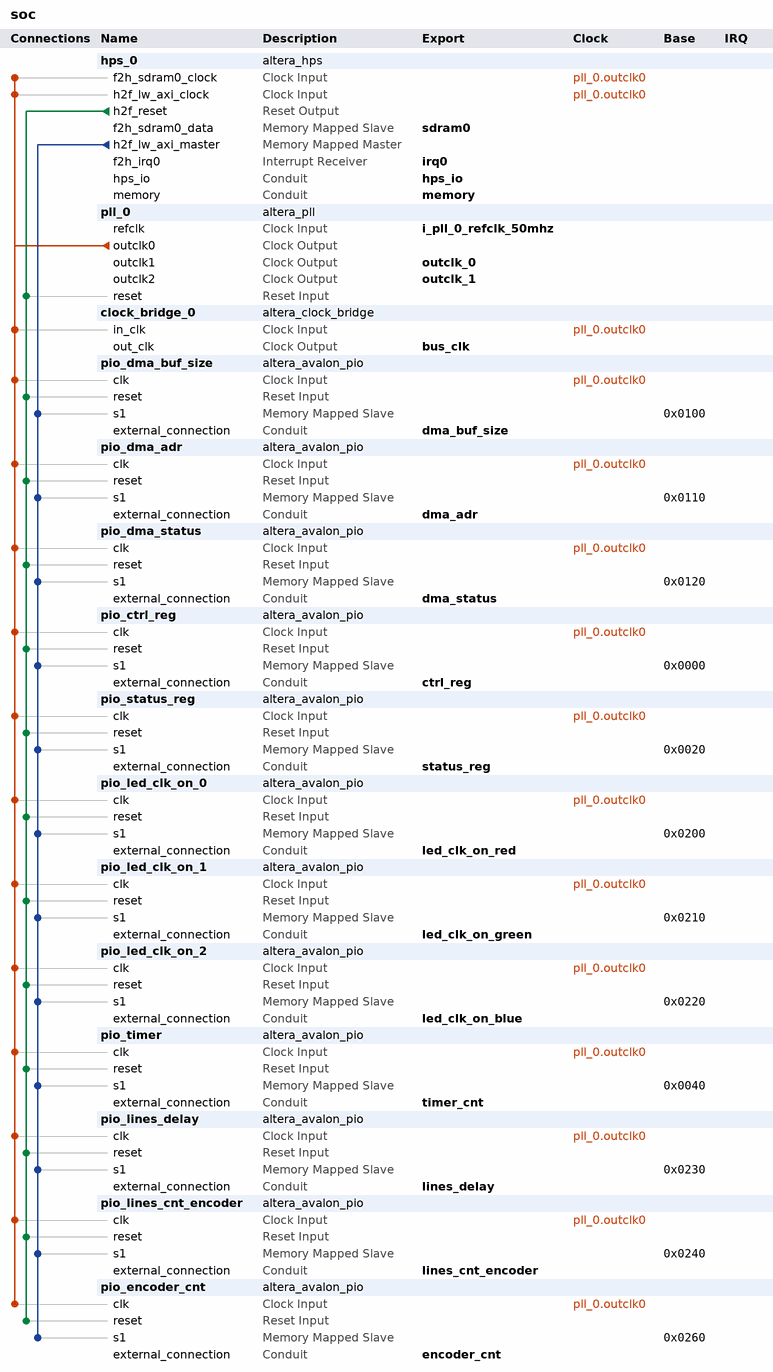
[diagram p0: system contents]
# Platform Designer (Qsys) system soc, Cyclone V 5CSEMA4U23C6
# Parameters at their usual value, and those the tool derives, are not listed.
package require -exact qsys 18.1
create_system soc
set_project_property DEVICE_FAMILY {Cyclone V}
set_project_property DEVICE 5CSEMA4U23C6

add_instance hps_0 altera_hps 18.1
set_instance_parameter_value hps_0 EMAC1_Mode RGMII
set_instance_parameter_value hps_0 EMAC1_PinMuxing {HPS I/O Set 0}
set_instance_parameter_value hps_0 F2SCLK_COLDRST_Enable false
set_instance_parameter_value hps_0 F2SCLK_DBGRST_Enable false
set_instance_parameter_value hps_0 F2SCLK_WARMRST_Enable false
set_instance_parameter_value hps_0 F2SDRAM_Type {Avalon-MM Bidirectional}
set_instance_parameter_value hps_0 F2SDRAM_Width 128
set_instance_parameter_value hps_0 F2SINTERRUPT_Enable true
set_instance_parameter_value hps_0 F2S_Width 0
set_instance_parameter_value hps_0 FPGA_PERIPHERAL_OUTPUT_CLOCK_FREQ_EMAC0_GTX_CLK 125
set_instance_parameter_value hps_0 FPGA_PERIPHERAL_OUTPUT_CLOCK_FREQ_EMAC0_MD_CLK 2.5
set_instance_parameter_value hps_0 FPGA_PERIPHERAL_OUTPUT_CLOCK_FREQ_EMAC1_GTX_CLK 125
set_instance_parameter_value hps_0 FPGA_PERIPHERAL_OUTPUT_CLOCK_FREQ_EMAC1_MD_CLK 2.5
set_instance_parameter_value hps_0 HPS_PROTOCOL DDR3
set_instance_parameter_value hps_0 I2C0_Mode I2C
set_instance_parameter_value hps_0 I2C0_PinMuxing {HPS I/O Set 0}
set_instance_parameter_value hps_0 I2C1_Mode I2C
set_instance_parameter_value hps_0 I2C1_PinMuxing {HPS I/O Set 0}
set_instance_parameter_value hps_0 LWH2F_Enable true
set_instance_parameter_value hps_0 MEM_BANKADDR_WIDTH 3
set_instance_parameter_value hps_0 MEM_CLK_FREQ 400.0
set_instance_parameter_value hps_0 MEM_COL_ADDR_WIDTH 10
set_instance_parameter_value hps_0 MEM_DQ_WIDTH 32
set_instance_parameter_value hps_0 MEM_DRV_STR RZQ/6
set_instance_parameter_value hps_0 MEM_ROW_ADDR_WIDTH 15
set_instance_parameter_value hps_0 MEM_RTT_NOM RZQ/6
set_instance_parameter_value hps_0 MEM_RTT_WR {Dynamic ODT off}
set_instance_parameter_value hps_0 MEM_TCL 7
set_instance_parameter_value hps_0 MEM_TFAW_NS 37.5
set_instance_parameter_value hps_0 MEM_TRAS_NS 35.0
set_instance_parameter_value hps_0 MEM_TRCD_NS 13.75
set_instance_parameter_value hps_0 MEM_TRFC_NS 300.0
set_instance_parameter_value hps_0 MEM_TRP_NS 13.75
set_instance_parameter_value hps_0 MEM_VENDOR Other
set_instance_parameter_value hps_0 MEM_WTCL 6
set_instance_parameter_value hps_0 QSPI_Mode N/A
set_instance_parameter_value hps_0 QSPI_PinMuxing Unused
set_instance_parameter_value hps_0 REF_CLK_FREQ 25.0
set_instance_parameter_value hps_0 S2FCLK_USER2CLK 5
set_instance_parameter_value hps_0 S2F_Width 0
set_instance_parameter_value hps_0 SDIO_Mode {4-bit Data}
set_instance_parameter_value hps_0 SDIO_PinMuxing {HPS I/O Set 0}
set_instance_parameter_value hps_0 SPIM1_Mode {Single Slave Select}
set_instance_parameter_value hps_0 SPIM1_PinMuxing {HPS I/O Set 0}
set_instance_parameter_value hps_0 STM_Enable false
set_instance_parameter_value hps_0 TIMING_BOARD_AC_SKEW 0.02
set_instance_parameter_value hps_0 TIMING_BOARD_AC_TO_CK_SKEW 0.0
set_instance_parameter_value hps_0 TIMING_BOARD_DQ_TO_DQS_SKEW 0.0
set_instance_parameter_value hps_0 TIMING_BOARD_MAX_CK_DELAY 0.6
set_instance_parameter_value hps_0 TIMING_BOARD_MAX_DQS_DELAY 0.6
set_instance_parameter_value hps_0 TIMING_BOARD_SKEW_BETWEEN_DQS 0.02
set_instance_parameter_value hps_0 TIMING_BOARD_SKEW_CKDQS_DIMM_MAX 0.01
set_instance_parameter_value hps_0 TIMING_BOARD_SKEW_CKDQS_DIMM_MIN -0.01
set_instance_parameter_value hps_0 TIMING_BOARD_SKEW_WITHIN_DQS 0.02
set_instance_parameter_value hps_0 TIMING_TDH 125
set_instance_parameter_value hps_0 TIMING_TDQSCK 400
set_instance_parameter_value hps_0 TIMING_TDQSQ 120
set_instance_parameter_value hps_0 TIMING_TDS 50
set_instance_parameter_value hps_0 TIMING_TIH 250
set_instance_parameter_value hps_0 TIMING_TIS 175
set_instance_parameter_value hps_0 TIMING_TQSH 0.38
set_instance_parameter_value hps_0 UART0_Mode {No Flow Control}
set_instance_parameter_value hps_0 UART0_PinMuxing {HPS I/O Set 0}
set_instance_parameter_value hps_0 USB1_Mode SDR
set_instance_parameter_value hps_0 USB1_PinMuxing {HPS I/O Set 0}
set_instance_parameter_value hps_0 desired_cfg_clk_mhz 100.0
set_instance_parameter_value hps_0 desired_qspi_clk_mhz 400.0

add_instance pll_0 altera_pll 18.1
set_instance_parameter_value pll_0 gui_actual_output_clock_frequency0 {509.375000 MHz}
set_instance_parameter_value pll_0 gui_device_speed_grade 1
set_instance_parameter_value pll_0 gui_number_of_clocks 3
set_instance_parameter_value pll_0 gui_operation_mode normal
set_instance_parameter_value pll_0 gui_output_clock_frequency0 80.0
set_instance_parameter_value pll_0 gui_output_clock_frequency1 8.0
set_instance_parameter_value pll_0 gui_output_clock_frequency2 8.0
set_instance_parameter_value pll_0 gui_pll_mode {Integer-N PLL}
set_instance_parameter_value pll_0 gui_ps_units1 degrees
set_instance_parameter_value pll_0 gui_ps_units2 degrees
set_instance_parameter_value pll_0 gui_reference_clock_frequency 50.0
set_instance_parameter_value pll_0 gui_use_locked false

add_instance clock_bridge_0 altera_clock_bridge 18.1
set_instance_parameter_value clock_bridge_0 DERIVED_CLOCK_RATE 80000000
set_instance_parameter_value clock_bridge_0 EXPLICIT_CLOCK_RATE 0

add_instance pio_dma_buf_size altera_avalon_pio 18.1
set_instance_parameter_value pio_dma_buf_size direction Output
set_instance_parameter_value pio_dma_buf_size width 32

add_instance pio_dma_adr altera_avalon_pio 18.1
set_instance_parameter_value pio_dma_adr direction Output
set_instance_parameter_value pio_dma_adr width 32

add_instance pio_dma_status altera_avalon_pio 18.1
set_instance_parameter_value pio_dma_status direction Input
set_instance_parameter_value pio_dma_status width 32

add_instance pio_ctrl_reg altera_avalon_pio 18.1
set_instance_parameter_value pio_ctrl_reg bitModifyingOutReg true
set_instance_parameter_value pio_ctrl_reg direction InOut
set_instance_parameter_value pio_ctrl_reg width 32

add_instance pio_status_reg altera_avalon_pio 18.1
set_instance_parameter_value pio_status_reg bitModifyingOutReg true
set_instance_parameter_value pio_status_reg direction Input
set_instance_parameter_value pio_status_reg width 32

add_instance pio_led_clk_on_0 altera_avalon_pio 18.1
set_instance_parameter_value pio_led_clk_on_0 direction Output
set_instance_parameter_value pio_led_clk_on_0 width 32

add_instance pio_led_clk_on_1 altera_avalon_pio 18.1
set_instance_parameter_value pio_led_clk_on_1 direction Output
set_instance_parameter_value pio_led_clk_on_1 width 32

add_instance pio_led_clk_on_2 altera_avalon_pio 18.1
set_instance_parameter_value pio_led_clk_on_2 direction Output
set_instance_parameter_value pio_led_clk_on_2 width 32

add_instance pio_timer altera_avalon_pio 18.1
set_instance_parameter_value pio_timer bitModifyingOutReg true
set_instance_parameter_value pio_timer direction Input
set_instance_parameter_value pio_timer width 32

add_instance pio_lines_delay altera_avalon_pio 18.1
set_instance_parameter_value pio_lines_delay direction Output
set_instance_parameter_value pio_lines_delay width 32

add_instance pio_lines_cnt_encoder altera_avalon_pio 18.1
set_instance_parameter_value pio_lines_cnt_encoder direction Output
set_instance_parameter_value pio_lines_cnt_encoder width 32

add_instance pio_encoder_cnt altera_avalon_pio 18.1
set_instance_parameter_value pio_encoder_cnt bitModifyingOutReg true
set_instance_parameter_value pio_encoder_cnt direction Input
set_instance_parameter_value pio_encoder_cnt width 32

# connections
add_connection pll_0.outclk0 clock_bridge_0.in_clk clock
add_connection pll_0.outclk0 hps_0.f2h_sdram0_clock clock
add_connection pll_0.outclk0 hps_0.h2f_lw_axi_clock clock
add_connection pll_0.outclk0 pio_ctrl_reg.clk clock
add_connection pll_0.outclk0 pio_dma_adr.clk clock
add_connection pll_0.outclk0 pio_dma_buf_size.clk clock
add_connection pll_0.outclk0 pio_dma_status.clk clock
add_connection pll_0.outclk0 pio_encoder_cnt.clk clock
add_connection pll_0.outclk0 pio_led_clk_on_0.clk clock
add_connection pll_0.outclk0 pio_led_clk_on_1.clk clock
add_connection pll_0.outclk0 pio_led_clk_on_2.clk clock
add_connection pll_0.outclk0 pio_lines_cnt_encoder.clk clock
add_connection pll_0.outclk0 pio_lines_delay.clk clock
add_connection pll_0.outclk0 pio_status_reg.clk clock
add_connection pll_0.outclk0 pio_timer.clk clock
add_connection hps_0.h2f_reset pio_ctrl_reg.reset reset
add_connection hps_0.h2f_reset pio_dma_adr.reset reset
add_connection hps_0.h2f_reset pio_dma_buf_size.reset reset
add_connection hps_0.h2f_reset pio_dma_status.reset reset
add_connection hps_0.h2f_reset pio_encoder_cnt.reset reset
add_connection hps_0.h2f_reset pio_led_clk_on_0.reset reset
add_connection hps_0.h2f_reset pio_led_clk_on_1.reset reset
add_connection hps_0.h2f_reset pio_led_clk_on_2.reset reset
add_connection hps_0.h2f_reset pio_lines_cnt_encoder.reset reset
add_connection hps_0.h2f_reset pio_lines_delay.reset reset
add_connection hps_0.h2f_reset pio_status_reg.reset reset
add_connection hps_0.h2f_reset pio_timer.reset reset
add_connection hps_0.h2f_reset pll_0.reset reset
add_connection hps_0.h2f_lw_axi_master pio_ctrl_reg.s1 avalon
set_connection_parameter_value hps_0.h2f_lw_axi_master/pio_ctrl_reg.s1 baseAddress 0x0000
add_connection hps_0.h2f_lw_axi_master pio_dma_adr.s1 avalon
set_connection_parameter_value hps_0.h2f_lw_axi_master/pio_dma_adr.s1 baseAddress 0x0110
add_connection hps_0.h2f_lw_axi_master pio_dma_buf_size.s1 avalon
set_connection_parameter_value hps_0.h2f_lw_axi_master/pio_dma_buf_size.s1 baseAddress 0x0100
add_connection hps_0.h2f_lw_axi_master pio_dma_status.s1 avalon
set_connection_parameter_value hps_0.h2f_lw_axi_master/pio_dma_status.s1 baseAddress 0x0120
add_connection hps_0.h2f_lw_axi_master pio_encoder_cnt.s1 avalon
set_connection_parameter_value hps_0.h2f_lw_axi_master/pio_encoder_cnt.s1 baseAddress 0x0260
add_connection hps_0.h2f_lw_axi_master pio_led_clk_on_0.s1 avalon
set_connection_parameter_value hps_0.h2f_lw_axi_master/pio_led_clk_on_0.s1 baseAddress 0x0200
add_connection hps_0.h2f_lw_axi_master pio_led_clk_on_1.s1 avalon
set_connection_parameter_value hps_0.h2f_lw_axi_master/pio_led_clk_on_1.s1 baseAddress 0x0210
add_connection hps_0.h2f_lw_axi_master pio_led_clk_on_2.s1 avalon
set_connection_parameter_value hps_0.h2f_lw_axi_master/pio_led_clk_on_2.s1 baseAddress 0x0220
add_connection hps_0.h2f_lw_axi_master pio_lines_cnt_encoder.s1 avalon
set_connection_parameter_value hps_0.h2f_lw_axi_master/pio_lines_cnt_encoder.s1 baseAddress 0x0240
add_connection hps_0.h2f_lw_axi_master pio_lines_delay.s1 avalon
set_connection_parameter_value hps_0.h2f_lw_axi_master/pio_lines_delay.s1 baseAddress 0x0230
add_connection hps_0.h2f_lw_axi_master pio_status_reg.s1 avalon
set_connection_parameter_value hps_0.h2f_lw_axi_master/pio_status_reg.s1 baseAddress 0x0020
add_connection hps_0.h2f_lw_axi_master pio_timer.s1 avalon
set_connection_parameter_value hps_0.h2f_lw_axi_master/pio_timer.s1 baseAddress 0x0040

# exported interfaces
add_interface bus_clk clock source
set_interface_property bus_clk EXPORT_OF clock_bridge_0.out_clk
add_interface ctrl_reg conduit end
set_interface_property ctrl_reg EXPORT_OF pio_ctrl_reg.external_connection
add_interface dma_adr conduit end
set_interface_property dma_adr EXPORT_OF pio_dma_adr.external_connection
add_interface dma_buf_size conduit end
set_interface_property dma_buf_size EXPORT_OF pio_dma_buf_size.external_connection
add_interface dma_status conduit end
set_interface_property dma_status EXPORT_OF pio_dma_status.external_connection
add_interface encoder_cnt conduit end
set_interface_property encoder_cnt EXPORT_OF pio_encoder_cnt.external_connection
add_interface hps_io conduit end
set_interface_property hps_io EXPORT_OF hps_0.hps_io
add_interface i_pll_0_refclk_50mhz clock sink
set_interface_property i_pll_0_refclk_50mhz EXPORT_OF pll_0.refclk
add_interface irq0 interrupt receiver
set_interface_property irq0 EXPORT_OF hps_0.f2h_irq0
add_interface led_clk_on_blue conduit end
set_interface_property led_clk_on_blue EXPORT_OF pio_led_clk_on_2.external_connection
add_interface led_clk_on_green conduit end
set_interface_property led_clk_on_green EXPORT_OF pio_led_clk_on_1.external_connection
add_interface led_clk_on_red conduit end
set_interface_property led_clk_on_red EXPORT_OF pio_led_clk_on_0.external_connection
add_interface lines_cnt_encoder conduit end
set_interface_property lines_cnt_encoder EXPORT_OF pio_lines_cnt_encoder.external_connection
add_interface lines_delay conduit end
set_interface_property lines_delay EXPORT_OF pio_lines_delay.external_connection
add_interface memory conduit end
set_interface_property memory EXPORT_OF hps_0.memory
add_interface outclk_0 clock source
set_interface_property outclk_0 EXPORT_OF pll_0.outclk1
add_interface outclk_1 clock source
set_interface_property outclk_1 EXPORT_OF pll_0.outclk2
add_interface sdram0 avalon slave
set_interface_property sdram0 EXPORT_OF hps_0.f2h_sdram0_data
add_interface status_reg conduit end
set_interface_property status_reg EXPORT_OF pio_status_reg.external_connection
add_interface timer_cnt conduit end
set_interface_property timer_cnt EXPORT_OF pio_timer.external_connection

set_interconnect_requirement {$system} qsys_mm.clockCrossingAdapter HANDSHAKE
set_interconnect_requirement {$system} qsys_mm.enableEccProtection FALSE
set_interconnect_requirement {$system} qsys_mm.insertDefaultSlave FALSE
set_interconnect_requirement {$system} qsys_mm.maxAdditionalLatency 1

save_system soc.qsys
